# Altium schematic sheet relay_circuit.SchDoc
size A; SheetNumber: 2; SheetTotal: 2
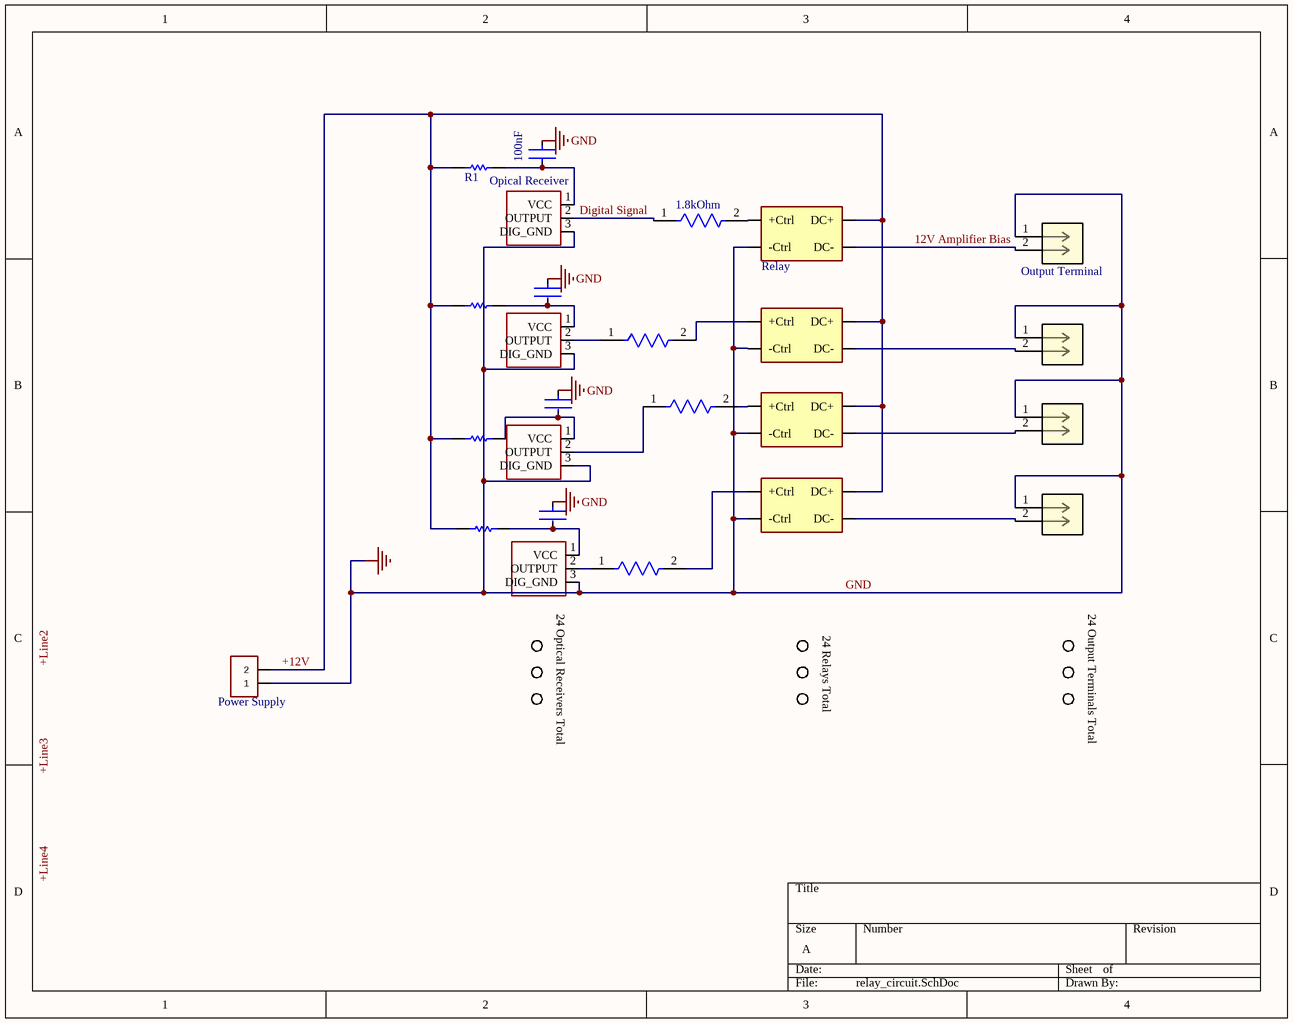
[diagram p0: relay_circuit.SchDoc]

## Parts
(Parts that share a designator on the sheet are numbered #1, #2 ... from top to bottom, then left to right.)
1.8kOhm#1  CRCW06031K80FKEA  [FP-CRCW0603-e3-MFG]  (value not drawn)
1.8kOhm#2  CRCW06031K80FKEA  [FP-CRCW0603-e3-MFG]  (value not drawn)
1.8kOhm#3  CRCW06031K80FKEA  [FP-CRCW0603-e3-MFG]  (value not drawn)
1.8kOhm#4  CRCW06031K80FKEA  [FP-CRCW0603-e3-MFG]  (value not drawn)
30R?#1  ERJ1GNF30R0C  [30 Ohm]  (value not drawn)
30R?#2  ERJ1GNF30R0C  [30 Ohm]  (value not drawn)
30R?#3  ERJ1GNF30R0C  [30 Ohm]  (value not drawn)
100nF  C0805C104K5RACTU  [100nF]  (value not drawn)
adfadfasdf  1054311102  [CONN_1054311102_MOL]  (value not drawn)
afd  IF-D95T  [IF-D95]  (value not drawn)
asdf  IF-D95T  [IF-D95]  (value not drawn)
C1  C0805C104K5RACTU  [100nF]  (value not drawn)
C2  C0805C104K5RACTU  [100nF]  (value not drawn)
C3  C0805C104K5RACTU  [100nF]  (value not drawn)
fasdfasdf  IF-D95T  [IF-D95]  (value not drawn)
getet  1054311102  [CONN_1054311102_MOL]  (value not drawn)
Opical_Receiver  IF-D95T  [IF-D95]  (value not drawn)
Output_Terminal  1054311102  [CONN_1054311102_MOL]  (value not drawn)
Power_Supply  PRPC001DFAN-RC  [PRPC001DFAN-RC]  (value not drawn)
R1  ERJ1GNF30R0C  [30 Ohm]  (value not drawn)
reagtaerw  Solid state relay  [CPC1002N]  (value not drawn)
reawgae  Solid state relay  [CPC1002N]  (value not drawn)
reawr  Solid state relay  [CPC1002N]  (value not drawn)
Relay  Solid state relay  [CPC1002N]  (value not drawn)
vdasvsvd  1054311102  [CONN_1054311102_MOL]  (value not drawn)

## Nets
GND: 100nF.1 adfadfasdf.1 afd.3(DIG_GND) asdf.3(DIG_GND) C1.1 C2.1 C3.1 fasdfasdf.3(DIG_GND) getet.1 Opical_Receiver.3(DIG_GND) Output_Terminal.1 Power_Supply.1 reagtaerw.2(-Ctrl) reawgae.2(-Ctrl) reawr.2(-Ctrl) Relay.2(-Ctrl) vdasvsvd.1
12V Amplifier Bias: Output_Terminal.2 Relay.3(DC-)
+12V: 30R?#1.1 30R?#2.1 30R?#3.1 Power_Supply.2 R1.1 reagtaerw.4(DC+) reawgae.4(DC+) reawr.4(DC+) Relay.4(DC+)
Digital Signal: 1.8kOhm#1.1 Opical_Receiver.2(OUTPUT)
Net1.8kOhm#1_2: 1.8kOhm#1.2 Relay.1(+Ctrl)
Net1.8kOhm#2_1: 1.8kOhm#2.1 asdf.2(OUTPUT)
Net1.8kOhm#2_2: 1.8kOhm#2.2 reawr.1(+Ctrl)
Net1.8kOhm#3_1: 1.8kOhm#3.1 afd.2(OUTPUT)
Net1.8kOhm#3_2: 1.8kOhm#3.2 reawgae.1(+Ctrl)
Net1.8kOhm#4_1: 1.8kOhm#4.1 fasdfasdf.2(OUTPUT)
Net1.8kOhm#4_2: 1.8kOhm#4.2 reagtaerw.1(+Ctrl)
Net30R?#1_2: 30R?#1.2 asdf.1(VCC) C3.2
Net30R?#2_2: 30R?#2.2 afd.1(VCC) C2.2
Net30R?#3_2: 30R?#3.2 C1.2 fasdfasdf.1(VCC)
Net100nF_2: 100nF.2 Opical_Receiver.1(VCC) R1.2
Netadfadfasdf_2: adfadfasdf.2 reawr.3(DC-)
Netgetet_2: getet.2 reagtaerw.3(DC-)
Netreawgae_3: reawgae.3(DC-) vdasvsvd.2

## Notes on the sheet
- (near fasdfasdf) 24 Optical Receivers Total
- 24 Relays Total
- 24 Output Terminals Total
- Labels drawn without touching a wire or pin: +Line2, +Line3, +Line4

## Library data of the parts
1.8kOhm#1-1.8kOhm#4 = CMP-02407-005782-1: RES Thick Film, 1.8kΩ, 1%, 0.1W, 100ppm/°C, 0603; Voltage Rating (DC): 75V; Max Power Dissipation: 100mW; Resistance: 1.8kR; Depth: 0.85mm; Contact Plating: Tin; Max Operating Temperature: 155°C; Package Quantity: 5000; Radiation Hardening: No; Temperature Coefficient: 100ppm/°C; Packaging: Tape and Reel; Number of Terminations: 2; Case Code (Imperial): 0603; Lead Free: Lead Free; Case/Package: 0603; Military Standard: Not; Weight: 7.1E-05oz; Tolerance: 1%; Height: 0.45mm; Min Operating Temperature: -55°C; Length: 1.55mm; Voltage Rating: 75V; Power Rating: 100mW; Width: 0.033inch; Composition: Thick Film; Case Code (Metric): 1608; Termination: SMD/SMT; Features: Automotive AEC-Q200
30R?#1-30R?#3 R1 = ERJ1GNF30R0C: Thick Film Resistors 0201 30ohm 1% HalogenFree AEC-Q200; Manufacturer: Panasonic; Resistance: 30R; Power Rating: 50mW; Voltage Rating: 25V; Temperature Coefficient: 200ppm/°C; Supplier 1: Digi-Key; Supplier Part Number 1: P122923CT-ND; Manufacturer Part Number: ERJ1GNF30R0C; RoHS: Yes; Category: Chip SMD Resistors; Stock 1: 45233; Pricing 1: 1=0.10000, 10=0.04600, 100=0.01890, 1000=0.00848, 2500=0.00736, 5000=0.00608 (USD); Mount: Surface Mount; Case/Package: 0201; Number of Pins: 2; Case Code (Metric): 0603; Case Code (Imperial): 0201; Weight: 6E-06oz; Min Operating Temperature: -55°C; Max Operating Temperature: 125°C; Packaging: Tape and Reel; Tolerance: 1%; Package Quantity: 15000; Resistor Type: Thick Film; Number of Terminations: 2; Termination: SMD/SMT; Max Power Dissipation: 50mW; Voltage Rating (DC): 25V; Series: ERJ; Construction: Rectangular; Resistance Tolerance: 1%; Length: 0.6mm; Width: 0.012inch; Height: 0.01inch; Depth: 0.3mm; Radiation Hardening: No; Military Standard: Not; RoHS Compliant: Yes; REACH SVHC: Unknown; ComponentLink1URL: https://datasheet.ciiva.com/43467/1678782-43467017.pdf?src-supplier=Farnell; ComponentLink1Description: https://datasheet.ciiva.com/43467/1678782-43467017.pdf?src-supplier=Farnell; ComponentLink2URL: https://datasheet.ciiva.com/46373/1678782-46373500.pdf?src-supplier=Element14; ComponentLink2Description: https://datasheet.ciiva.com/46373/1678782-46373500.pdf?src-supplier=Element14; ComponentLink3URL: https://datasheet.ciiva.com/24128/aoa0000ce2-24128351.pdf?src-supplier=Mouser; ComponentLink3Description: https://datasheet.ciiva.com/24128/aoa0000ce2-24128351.pdf?src-supplier=Mouser
100nF C1-C3 = C0805C104K5RACTU: Cap Ceramic 0.1uF 50V X7R 10% SMD 2.0 x 1.2 mm 125 C Paper T/R; Manufacturer: KEMET; Voltage: 500V; Supplier 1: Digi-Key; Supplier Part Number 1: 399-1170-1-ND; Manufacturer Part Number: C0805C104K5RACTU; RoHS: Yes; Category: Ceramic Capacitors; Stock 1: 2447786; Pricing 1: 1=0.15000, 10=0.11000, 50=0.06220, 100=0.05150, 500=0.03612, 1000=0.02991 (USD); Mount: Surface Mount,PCB; Case/Package: 0805; Number of Pins: 2; Case Code (Imperial): 0805; Case Code (Metric): 2012; Contact Plating: Tin,Matte; Dielectric Material: Ceramic; Min Operating Temperature: -55°C; Max Operating Temperature: 125°C; Capacitance: 100nF; Voltage Rating: 50V; Tolerance: 10%; Packaging: Tape and Reel; Dielectric: X7R; Package Quantity: 4000; Voltage Rating (DC): 50V; Series: C0805C; Termination: SMD/SMT; Construction: Flat; Length: 2mm; Width: 1.2mm; Height: 0.9mm; Thickness: 0.035inch; Depth: 1.25mm; Lead Pitch: 0.75mm; Radiation Hardening: No; RoHS Compliant: Yes; REACH SVHC: No SVHC; ComponentLink1URL: https://datasheet.ciiva.com/28682/1851736-28682232.pdf?src-supplier=Element14; ComponentLink1Description: https://datasheet.ciiva.com/28682/1851736-28682232.pdf?src-supplier=Element14; ComponentLink2URL: https://datasheet.ciiva.com/14589/70095383-14589048.pdf?src-supplier=Allied+Electronics; ComponentLink2Description: https://datasheet.ciiva.com/14589/70095383-14589048.pdf?src-supplier=Allied+Electronics; ComponentLink3URL: https://datasheet.ciiva.com/32431/slceramic-chip-condensers-e-32431755.pdf?src-supplier=Distrelec; ComponentLink3Description: https://datasheet.ciiva.com/32431/slceramic-chip-condensers-e-32431755.pdf?src-supplier=Distrelec; ComponentLink4URL: https://datasheet.ciiva.com/18410/70095383-18410815.pdf?src-supplier=Allied+Electronics; ComponentLink4Description: https://datasheet.ciiva.com/18410/70095383-18410815.pdf?src-supplier=Allied+Electronics
adfadfasdf getet Output_Terminal vdasvsvd = 1054311102: Nano-Fit Vertical Header, Surface Mount, 2.50mm Pitch, Single Row, 2 Circuits, 0.76 u00B5m Tin (Sn) Plating, Black,...; Manufacturer: Molex; Supplier 1: Digi-Key; Supplier Part Number 1: WM26073CT-ND; Manufacturer Part Number: 1054311102; RoHS: No; Category: Connectors; Stock 1: 1192; Pricing 1: 1=2.05000, 10=1.85700, 100=1.59160 (USD)
afd asdf fasdfasdf Opical_Receiver = IF-D95T: DETECTOR PHOTOLOGIC TTL/CMOS; Manufacturer: Industrial Fiber Optics; Data Rate: 125Kbps; Operating Supply Current: 6mA; Rise Time: 70ns; Supplier 1: Digi-Key; Supplier Part Number 1: FB123-ND; Manufacturer Part Number: IF-D95T; RoHS: No; Category: Fiber Optic Cables; Package Quantity: 50; Lead Free: Contains Lead; ComponentLink1URL: https://datasheet.ciiva.com/2106/ifd95-2106550.pdf?src-supplier=Digi-Key; ComponentLink1Description: https://datasheet.ciiva.com/2106/ifd95-2106550.pdf?src-supplier=Digi-Key
Power_Supply = PRPC001DFAN-RC: Conn Header Vert 2POS; Manufacturer: Sullins; Number of Positions: 2; Connector Type: Male Pin; Row Spacing: 0.1inch; Supplier 1: Digi-Key; Supplier Part Number 1: S2211EC-01-ND; Manufacturer Part Number: PRPC001DFAN-RC; RoHS: Yes; Category: Connectors; Stock 1: 5964; Pricing 1: 1=0.09000, 10=0.08300, 25=0.06160, 50=0.05280, 100=0.05110, 250=0.04404, 500=0.04226 (USD); Mount: Through Hole; Color: Black; Contact Plating: Gold; Packaging: Bulk; Number of Rows: 2; Package Quantity: 1; Termination: Solder; Contact Mating Length: 0.318inch; ComponentLink1URL: https://datasheet.ciiva.com/741/xrxczzzdxxn-rc-11636-b-741404.pdf?src-supplier=Digi-Key; ComponentLink1Description: https://datasheet.ciiva.com/741/xrxczzzdxxn-rc-11636-b-741404.pdf?src-supplier=Digi-Key
reagtaerw reawgae reawr Relay = CPC1002N